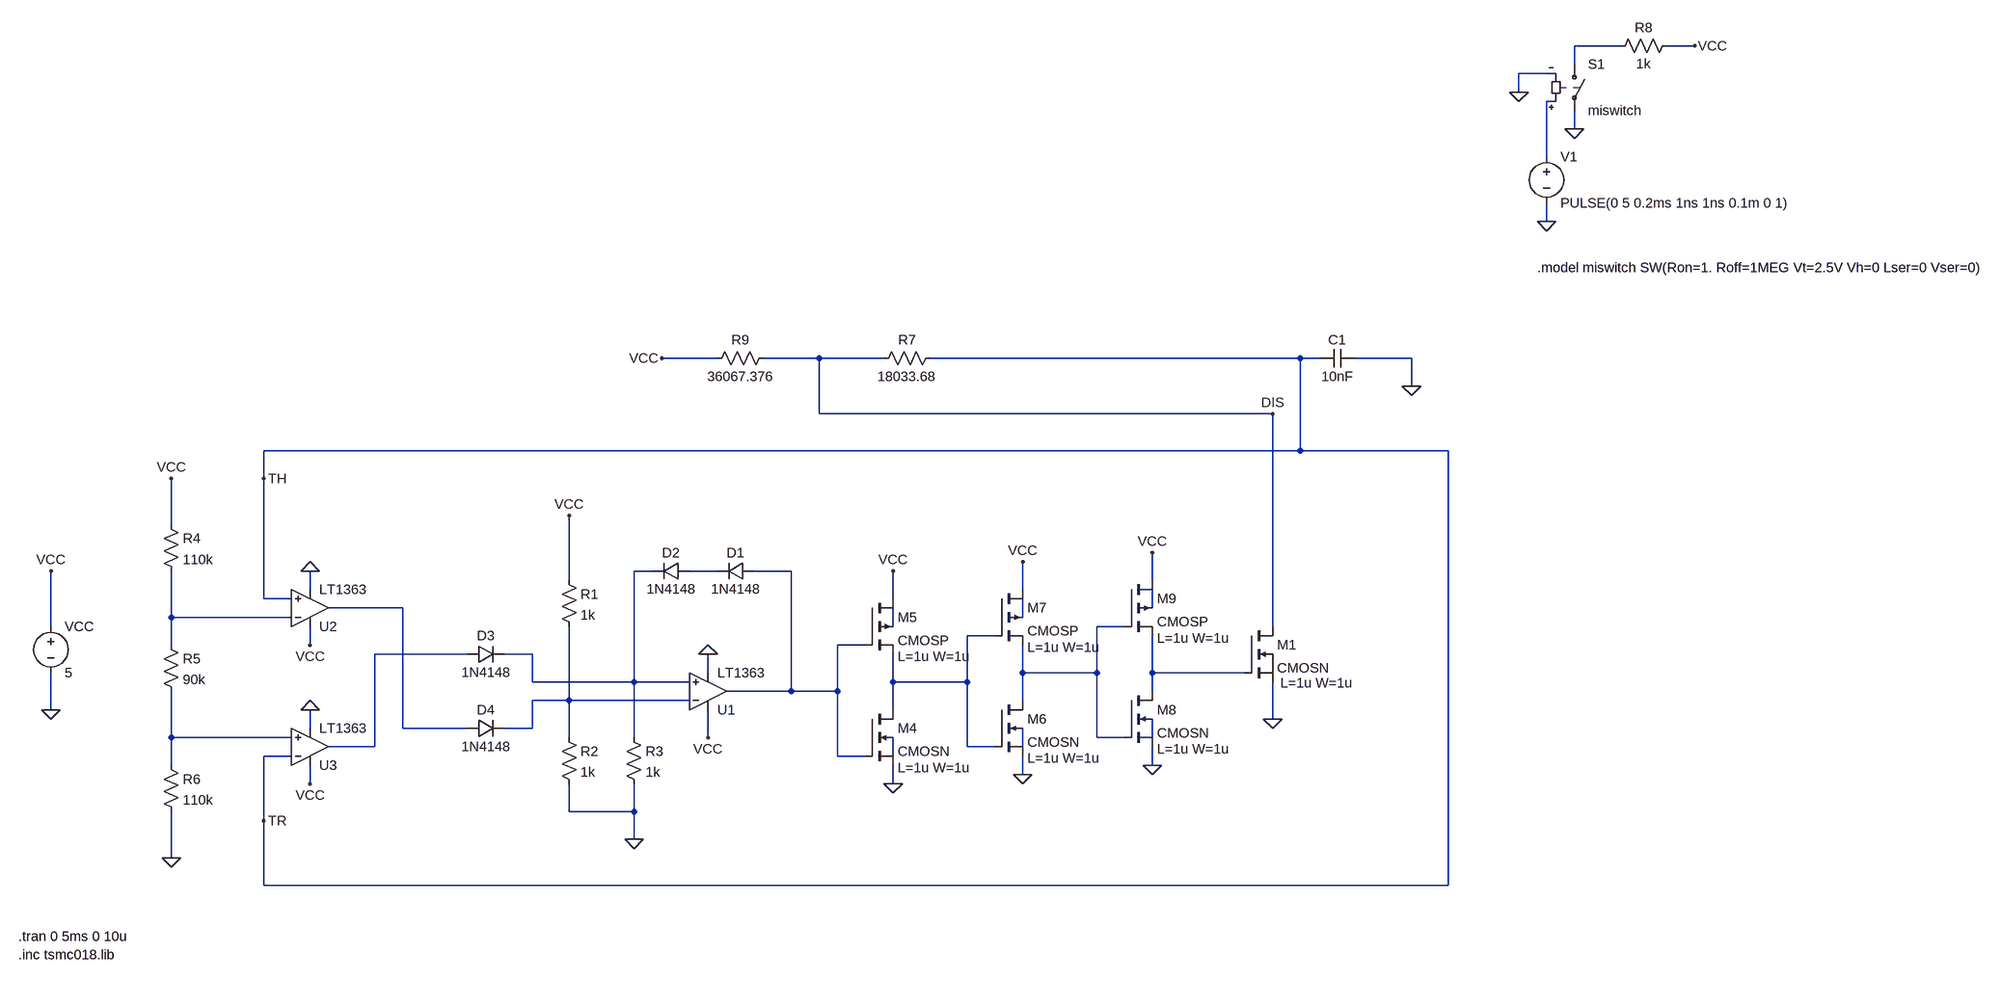
[diagram p0: schematic q1.asc]
q1.asc, the LTspice schematic file:
Version 4.1
SHEET 1 2672 1412
WIRE 1968 -1088 1888 -1088
WIRE 2096 -1088 2048 -1088
WIRE 1888 -1056 1888 -1088
WIRE 1840 -1040 1792 -1040
WIRE 1792 -1008 1792 -1040
WIRE 1888 -944 1888 -976
WIRE 1840 -896 1840 -992
WIRE 1840 -784 1840 -816
WIRE 208 -416 112 -416
WIRE 384 -416 288 -416
WIRE 496 -416 384 -416
WIRE 1216 -416 576 -416
WIRE 1248 -416 1216 -416
WIRE 1408 -416 1312 -416
WIRE 1408 -368 1408 -416
WIRE 384 -320 384 -416
WIRE 1168 -320 384 -320
WIRE 1216 -256 1216 -416
WIRE 1216 -256 -576 -256
WIRE 1472 -256 1216 -256
WIRE -576 -208 -576 -256
WIRE -736 -128 -736 -208
WIRE 96 -48 64 -48
WIRE 208 -48 160 -48
WIRE 336 -48 272 -48
WIRE -48 -32 -48 -144
WIRE 960 -32 960 -80
WIRE -496 -16 -496 -48
WIRE 736 -16 736 -64
WIRE -576 0 -576 -208
WIRE -528 0 -576 0
WIRE 512 0 512 -48
WIRE -336 16 -464 16
WIRE 960 16 960 -16
WIRE -736 32 -736 -48
WIRE -528 32 -736 32
WIRE 736 32 736 0
WIRE -944 48 -944 -48
WIRE 512 48 512 16
WIRE 912 48 864 48
WIRE 1168 48 1168 -320
WIRE 688 64 640 64
WIRE -736 80 -736 32
WIRE -496 80 -496 48
WIRE 464 80 416 80
WIRE -224 96 -384 96
WIRE -112 96 -160 96
WIRE 192 128 192 96
WIRE 736 128 736 80
WIRE 864 128 864 48
WIRE 864 128 736 128
WIRE 960 128 960 64
WIRE 1120 128 960 128
WIRE -112 144 -112 96
WIRE 64 144 64 -48
WIRE 64 144 -112 144
WIRE 160 144 64 144
WIRE 512 144 512 96
WIRE 640 144 640 64
WIRE 640 144 512 144
WIRE 336 160 336 -48
WIRE 336 160 224 160
WIRE 416 160 416 80
WIRE 416 160 336 160
WIRE 960 160 960 128
WIRE -48 176 -48 48
WIRE -48 176 -112 176
WIRE 160 176 -48 176
WIRE 736 176 736 128
WIRE -944 192 -944 128
WIRE 512 192 512 144
WIRE 1168 208 1168 144
WIRE -496 224 -496 192
WIRE -336 224 -336 16
WIRE -224 224 -336 224
WIRE -112 224 -112 176
WIRE -112 224 -160 224
WIRE -736 240 -736 160
WIRE -528 240 -736 240
WIRE -48 240 -48 176
WIRE 64 240 64 144
WIRE 192 240 192 192
WIRE 864 240 864 128
WIRE 912 240 864 240
WIRE 960 240 960 208
WIRE -384 256 -384 96
WIRE -384 256 -464 256
WIRE 640 256 640 144
WIRE 688 256 640 256
WIRE 736 256 736 224
WIRE -528 272 -576 272
WIRE 416 272 416 160
WIRE 464 272 416 272
WIRE 512 272 512 240
WIRE -736 288 -736 240
WIRE 960 288 960 256
WIRE 736 304 736 272
WIRE -496 320 -496 288
WIRE 512 320 512 288
WIRE -48 368 -48 320
WIRE 64 368 64 320
WIRE 64 368 -48 368
WIRE -576 384 -576 272
WIRE 64 416 64 368
WIRE -736 448 -736 368
WIRE -576 496 -576 384
WIRE 1472 496 1472 -256
WIRE 1472 496 -576 496
FLAG 64 416 0
FLAG 192 96 0
FLAG -48 -144 VCC
FLAG -496 80 VCC
FLAG -496 -48 0
FLAG -496 320 VCC
FLAG -496 192 0
FLAG -736 -208 VCC
FLAG -736 448 0
FLAG -576 -208 TH
FLAG -576 384 TR
FLAG 512 320 0
FLAG 512 -48 VCC
FLAG 736 304 0
FLAG 736 -64 VCC
FLAG 960 288 0
FLAG 960 -80 VCC
FLAG 1168 -320 DIS
FLAG 2096 -1088 VCC
FLAG 1888 -944 0
FLAG 1792 -1008 0
FLAG 1840 -784 0
FLAG 192 240 VCC
FLAG 112 -416 VCC
FLAG -944 192 0
FLAG -944 -48 VCC
FLAG 1168 208 0
FLAG 1408 -368 0
SYMBOL OpAmps\\LT1363 192 224 M180
SYMATTR InstName U1
SYMBOL diode 272 -64 R90
WINDOW 0 0 32 VBottom 2
WINDOW 3 32 32 VTop 2
SYMATTR InstName D1
SYMATTR Value 1N4148
SYMBOL diode 160 -64 R90
WINDOW 0 0 32 VBottom 2
WINDOW 3 32 32 VTop 2
SYMATTR InstName D2
SYMATTR Value 1N4148
SYMBOL res 48 224 R0
SYMATTR InstName R3
SYMATTR Value 1k
SYMBOL res -64 224 R0
SYMATTR InstName R2
SYMATTR Value 1k
SYMBOL res -64 -48 R0
SYMATTR InstName R1
SYMATTR Value 1k
SYMBOL diode -224 112 R270
WINDOW 0 32 32 VTop 2
WINDOW 3 0 32 VBottom 2
SYMATTR InstName D3
SYMATTR Value 1N4148
SYMBOL diode -224 240 R270
WINDOW 0 32 32 VTop 2
WINDOW 3 0 32 VBottom 2
SYMATTR InstName D4
SYMATTR Value 1N4148
SYMBOL OpAmps\\LT1363 -496 80 M180
SYMATTR InstName U2
SYMBOL OpAmps\\LT1363 -496 320 M180
SYMATTR InstName U3
SYMBOL res -752 -144 R0
SYMATTR InstName R4
SYMATTR Value 110k
SYMBOL res -752 64 R0
SYMATTR InstName R5
SYMATTR Value 90k
SYMBOL res -752 272 R0
SYMATTR InstName R6
SYMATTR Value 110k
SYMBOL nmos 1120 48 R0
WINDOW 123 62 98 Left 2
SYMATTR Value2 L=1u W=1u
SYMATTR InstName M1
SYMATTR Value CMOSN
SYMBOL nmos4 464 192 R0
WINDOW 123 56 100 Left 2
SYMATTR Value2 L=1u W=1u
SYMATTR InstName M4
SYMATTR Value CMOSN
SYMBOL pmos4 464 0 R0
WINDOW 123 56 100 Left 2
SYMATTR Value2 L=1u W=1u
SYMATTR InstName M5
SYMATTR Value CMOSP
SYMBOL nmos4 688 176 R0
WINDOW 123 56 100 Left 2
SYMATTR Value2 L=1u W=1u
SYMATTR InstName M6
SYMATTR Value CMOSN
SYMBOL pmos4 688 -16 R0
WINDOW 123 56 100 Left 2
SYMATTR Value2 L=1u W=1u
SYMATTR InstName M7
SYMATTR Value CMOSP
SYMBOL nmos4 912 160 R0
WINDOW 123 56 100 Left 2
SYMATTR Value2 L=1u W=1u
SYMATTR InstName M8
SYMATTR Value CMOSN
SYMBOL pmos4 912 -32 R0
WINDOW 123 56 100 Left 2
SYMATTR Value2 L=1u W=1u
SYMATTR InstName M9
SYMATTR Value CMOSP
SYMBOL sw 1888 -1072 R0
SYMATTR InstName S1
SYMATTR Value miswitch
SYMBOL res 2064 -1104 R90
WINDOW 0 0 56 VBottom 2
WINDOW 3 32 56 VTop 2
SYMATTR InstName R8
SYMATTR Value 1k
SYMBOL voltage 1840 -912 R0
WINDOW 123 0 0 Left 0
WINDOW 39 0 0 Left 0
SYMATTR InstName V1
SYMATTR Value PULSE(0 5 0.2ms 1ns 1ns 0.1m 0 1)
SYMBOL res 592 -432 R90
WINDOW 0 0 56 VBottom 2
WINDOW 3 32 56 VTop 2
SYMATTR InstName R7
SYMATTR Value 18033.68
SYMBOL res 304 -432 R90
WINDOW 0 0 56 VBottom 2
WINDOW 3 32 56 VTop 2
SYMATTR InstName R9
SYMATTR Value 36067.376
SYMBOL cap 1312 -432 R90
WINDOW 0 0 32 VBottom 2
WINDOW 3 32 32 VTop 2
SYMATTR InstName C1
SYMATTR Value 10nF
SYMBOL voltage -944 32 R0
WINDOW 123 0 0 Left 0
WINDOW 39 0 0 Left 0
SYMATTR InstName VCC
SYMATTR Value 5
TEXT -1000 616 Left 2 !.inc tsmc018.lib
TEXT -1000 584 Left 2 !.tran 0 5ms 0 10u
TEXT 1824 -704 Left 2 !.model miswitch SW(Ron=1. Roff=1MEG Vt=2.5V Vh=0 Lser=0 Vser=0)

The netlist it stands for:
* q1.asc
X§U1 N003 N015 VCC 0 N005 LT1363  ; pins In+ In- V+ V- OUT
D1 N005 N004 1N4148
D2 N004 N003 1N4148
R3 N003 0 1k
R2 N015 0 1k
R1 VCC N015 1k
D3 N013 N003 1N4148
D4 N006 N015 1N4148
X§U2 TR N008 VCC 0 N006 LT1363  ; pins In+ In- V+ V- OUT
X§U3 N016 TR VCC 0 N013 LT1363  ; pins In+ In- V+ V- OUT
R4 VCC N008 110k
R5 N008 N016 90k
R6 N016 0 110k
M1 DIS N014 0 0 CMOSN L=1u W=1u
M4 N012 N005 0 N019 CMOSN L=1u W=1u
M5 VCC N005 N012 N010 CMOSP L=1u W=1u
M6 N011 N012 0 N018 CMOSN L=1u W=1u
M7 VCC N012 N011 N009 CMOSP L=1u W=1u
M8 N014 N011 0 N017 CMOSN L=1u W=1u
M9 VCC N011 N014 N007 CMOSP L=1u W=1u
S1 N001 0 N002 0 miswitch
R8 VCC N001 1k
V1 N002 0 PULSE(0 5 0.2ms 1ns 1ns 0.1m 0 1)
R7 TR DIS 18033.68
R9 DIS VCC 36067.376
C1 0 TR 10nF
VCC VCC 0 5
.model D D
.lib standard.dio
.model NMOS NMOS
.model PMOS PMOS
.lib standard.mos
.inc tsmc018.lib
.tran 0 5ms 0 10u
.model miswitch SW(Ron=1. Roff=1MEG Vt=2.5V Vh=0 Lser=0 Vser=0)
.lib LT1363.sub
.backanno
.end